# EAGLE design digAudio-PLT133 (EAGLE 6.4)
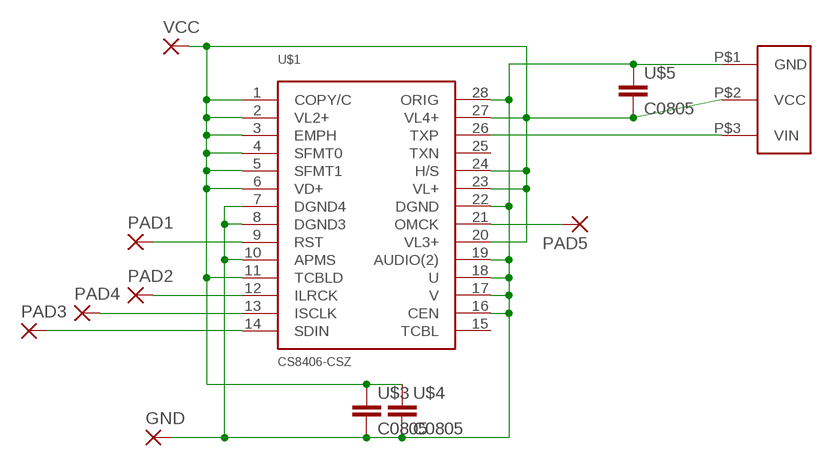
[diagram p0: schematic, sheet 1]

## Parts
GND  SMD2  [SMD1,27-2,54]
PAD1  SMD2  [SMD1,27-2,54]
PAD2  SMD2  [SMD1,27-2,54]
PAD3  SMD2  [SMD1,27-2,54]
PAD4  SMD2  [SMD1,27-2,54]
PAD5  SMD2  [SMD1,27-2,54]
U$1  CS8406-CSZ  [SO28W]
U$3  C0805  [Z0805]
U$4  C0805  [Z0805]
U$5  C0805  [Z0805]
U$6  PLT133/T10W  [PLT133/T10W]
VCC  SMD2  [SMD1,27-2,54]

## Nets
GND: GND.1(P) U$1.7(DGND4) U$1.8(DGND3) U$1.10(APMS) U$1.16(CEN) U$1.17(V) U$1.18(U) U$1.19(AUDIO(2)) U$1.22(DGND) U$1.28(ORIG) U$3.2 U$4.2 U$5.1 U$6.P$1(GND)
N$1: U$1.26(TXP) U$6.P$3(VIN)
N$2: PAD1.1(P) U$1.9(RST)
N$3: PAD2.1(P) U$1.12(ILRCK)
N$4: PAD4.1(P) U$1.13(ISCLK)
N$5: PAD3.1(P) U$1.14(SDIN)
N$6: PAD5.1(P) U$1.21(OMCK)
VCC: U$1.1(COPY/C) U$1.2(VL2+) U$1.3(EMPH) U$1.4(SFMT0) U$1.5(SFMT1) U$1.6(VD+) U$1.11(TCBLD) U$1.20(VL3+) U$1.23(VL+) U$1.24(H/S) U$1.27(VL4+) U$3.1 U$4.1 U$5.2 U$6.P$2(VCC) VCC.1(P)
Unconnected: U$1.15(TCBL) U$1.25(TXN)

## Library data of the parts
GND PAD1-PAD5 VCC = wirepad:SMD2: SMD PAD
U$1 = cs8406:CS8406-CSZ
U$3-U$5 = snescart:C0805
U$6 = cs8406:PLT133/T10W

## Board
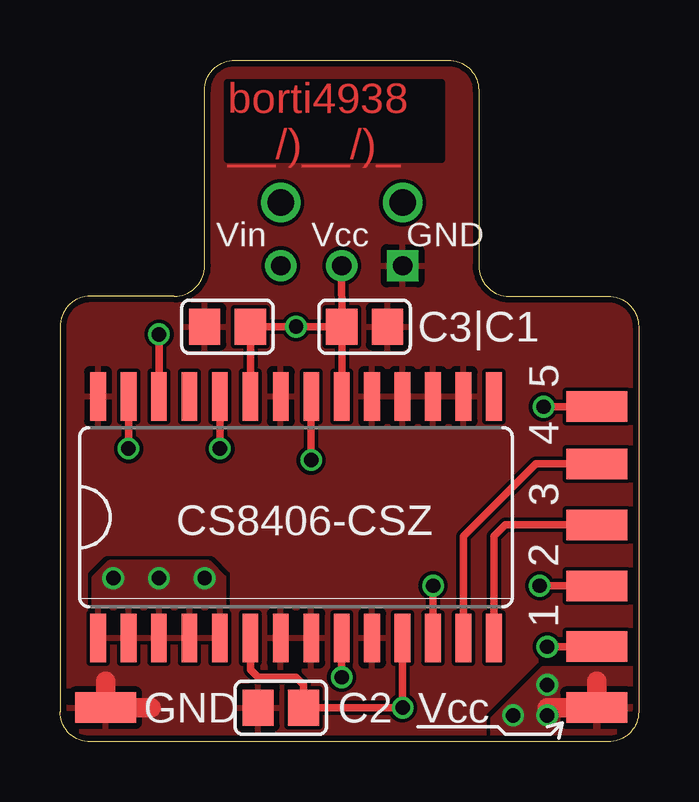
[diagram p1: board, top side]
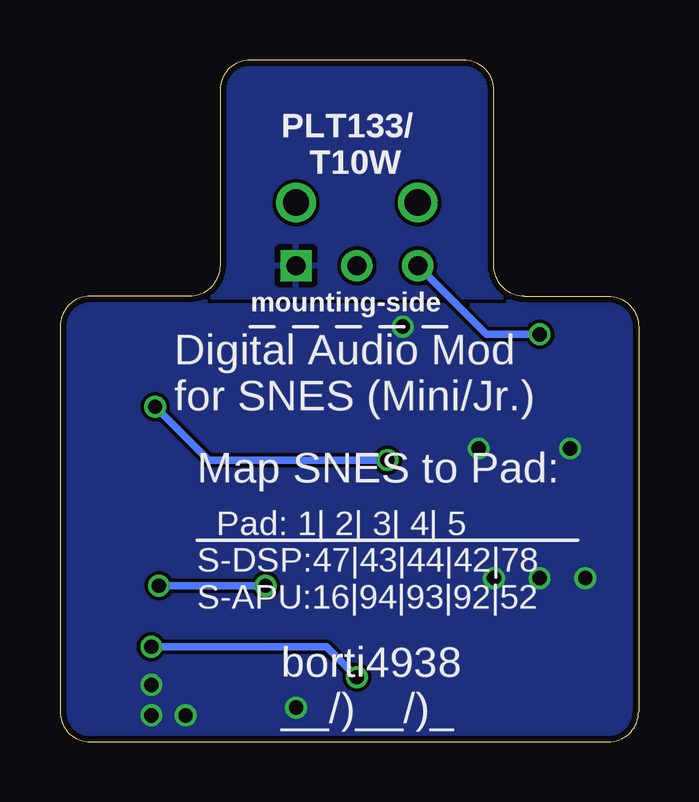
[diagram p2: board, bottom side, seen from below]

Size 24.13 x 28.42 mm. Coordinates in mm from the lower left corner, seen from the top.
Outline: 6.03,27.15 arc-90 7.3,28.42 16.19,28.42 arc-90 17.46,27.15 17.46,19.84 arc90 18.73,18.57 22.86,18.57 arc-90 24.13,17.3 24.13,1.27 arc-90 22.86,0 1.27,0 arc-90 0,1.27 0,17.3 arc-90 1.27,18.57 4.76,18.57 arc90 6.03,19.84 6.03,27.15
Copper layers (1*16): Top 0.035mm / dielectric 1.5mm / Bottom 0.035mm
Design rules "Elecrow_2-layer_eagle_rule": minimum track width 6mil, minimum drill 12mil, track to track 6mil, track to pad 6mil, pad to pad 6mil, via to via 6mil, smd to smd 0mil, copper to edge 10mil, drill to drill 10mil, minimum pad ring 10mil, minimum via ring 6mil, stop-mask expansion 2mil, vias tented up to drill 100mil, thermal gap 10mil

### Footprints (pad centres in the part's own frame; a part is rotated, then mirrored left to right if it is on the bottom)
SMD1,27-2,54 = smd 1.27 x 2.54: 1 0,0
SO28W = smd 0.66 x 2.032: 1 -6.985,-5.029; 2 -5.715,-5.029; 3 -4.445,-5.029; 4 -3.175,-5.029; 5 -1.905,-5.029; 6 -0.635,-5.029; 7 0.635,-5.029; 8 1.905,-5.029; 9 3.175,-5.029; 10 4.445,-5.029; 11 5.715,-5.029; 12 6.985,-5.029; 13 8.255,-5.029; 14 9.525,-5.029; 15 9.525,5.029; 16 8.255,5.029; 17 6.985,5.029; 18 5.715,5.029; 19 4.445,5.029; 20 3.175,5.029; 21 1.905,5.029; 22 0.635,5.029; 23 -0.635,5.029; 24 -1.905,5.029; 25 -3.175,5.029; 26 -4.445,5.029; 27 -5.715,5.029; 28 -6.985,5.029
Z0805 = smd 1.3 x 1.5: 1 -0.95,0; 2 0.95,0
PLT133/T10W = drill 0.8 square: P$1 -2.54,0 | drill 0.8: P$2 0,0; P$3 2.54,0 | drill 1.1: P$4 2.54,2.63; P$5 -2.54,2.63

### Placement (x,y rotation side)
GND  1.91,1.43 270 top
PAD1  22.38,3.97 90 top
PAD2  22.38,6.51 90 top
PAD3  22.38,9.05 90 top
PAD4  22.38,11.59 90 top
PAD5  22.38,13.97 90 top
U$1  8.57,9.37 0 top
U$3  9.21,1.43 180 top
U$4  6.99,17.3 180 top
U$5  12.7,17.3 180 top
U$6  11.75,19.84 0 bottom
VCC  22.38,1.43 90 top

### Tracks (layer width: path | path; a pad name or v marks a point on that pad's centre or on a via)
GND
  Top 0.813: 3.81,1.43 GND.1 1.91,2.54
  pour Top (rank 2): -4.76,-14.45 29.53,-14.45 29.53,28.73 -4.76,28.73
  pour Bottom: -4.76,28.73 29.53,28.73 29.53,18.57 -4.76,18.57
N$1  (via drill 0.6)
  Top 0.305: U$1.26 v4.13,16.99
  Bottom 0.305: v4.13,16.99 6.35,16.99 U$6.P$3
N$2  (via drill 0.6)
  Top 0.305: PAD1.1 v20.32,3.97 | v11.75,2.7 U$1.9
  Bottom 0.305: v20.32,3.97 13.02,3.97 v11.75,2.7
N$3  (via drill 0.6)
  Top 0.305: PAD2.1 v20,6.51 | v15.56,6.51 U$1.12
  Bottom 0.305: v20,6.51 v15.56,6.51
N$4
  Top 0.305: U$1.13 16.83,8.57 19.84,11.59 PAD4.1
N$5
  Top 0.305: U$1.14 18.1,8.57 18.57,9.05 PAD3.1
N$6  (via drill 0.6)
  Top 0.305: PAD5.1 v20.16,13.97 | v10.48,11.75 U$1.21
  Bottom 0.305: v20.16,13.97 17.94,11.75 v10.48,11.75
VCC  (via drill 0.6)
  Top 0.305: U$1.24 v6.67,12.22 | v2.86,12.22 U$1.27 | U$1.23 7.94,16.99 U$4.1 v9.84,17.3 U$5.2 | U$5.2 U$6.P$2 | U$1.20 U$5.2 | U$1.6 7.94,3.02 8.26,2.7 9.84,2.7 10.16,2.38 U$3.1 | U$3.1 | U$3.1 v14.28,1.43 v14.29,1.43 U$1.11
  Top 0.813: 22.38,2.54 VCC.1 20.32,1.43
  other vias: 6.03,6.83 2.22,6.83 18.89,1.11 20.32,2.38 20.32,1.11 4.13,6.83
  pour Bottom (rank 2): -4.76,-14.45 29.53,-14.45 29.53,28.73 -4.76,28.73
  pour Top: 1.43,3.65 6.83,3.65 6.83,6.83 6.19,7.46 2.06,7.46 1.43,6.83
  pour Top: 25.08,-0.48 25.08,3.02 20.16,3.02 18.1,0.95 18.1,-0.48

### Text on the board
Top: borti4938 / __/)__/)_
tNames: Vin | Vcc | GND | C3|C1 | 5 | 4 | 3 | 2 | 1 | GND | C2 | Vcc
bNames: Digital Audio Mod / for SNES (Mini/Jr.) | Map SNES to Pad: | Pad: 1| 2| 3| 4| 5 / S-DSP:47|43|44|42|78 / S-APU:16|94|93|92|52 | borti4938 / __/)__/)_
tStop: b | o | r | t | i | 4 | 9 | 3 | 8 | _ | _ | / | ) | _ | _ | / | ) | _